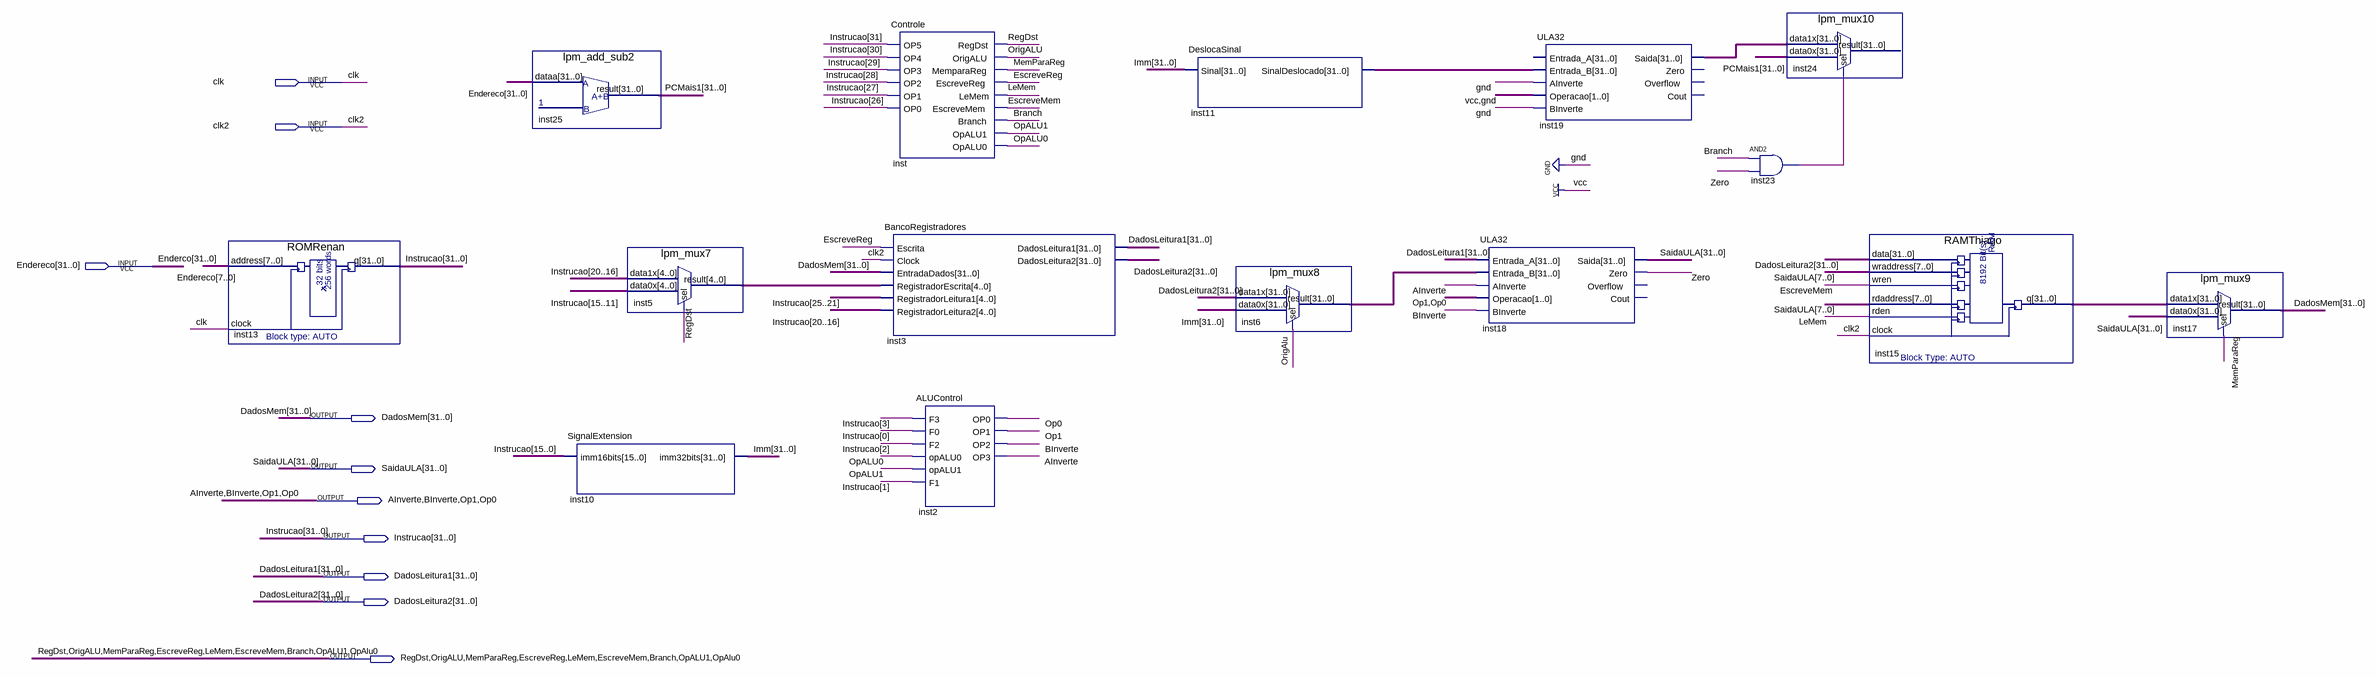
[diagram p0: schematic sheet]
// Quartus schematic MIPSUnicicloManual.bdf as structural Verilog: 15 symbols, 10 pins
module MIPSUnicicloManual (
  input  clk,
  input  clk2,
  input  [31:0] Endereco,
  output [31:0] DadosMem,
  output [31:0] SaidaULA,
  output AInverte,
  output BInverte,
  output Op1,
  output Op0,
  output [31:0] Instrucao,
  output [31:0] DadosLeitura1,
  output [31:0] DadosLeitura2,
  output RegDst,
  output OrigALU,
  output MemParaReg,
  output EscreveReg,
  output LeMem,
  output EscreveMem,
  output Branch,
  output OpALU1,
  output OpAlu0
);

  wire inst23_out, Zero;
  wire [4:0] inst5_result;
  wire [31:0] Imm, inst6_result, inst11_sinaldeslocado, inst15_q, inst19_saida, PCMais1;

  ROMRenan inst13 (.address(Endereco[7:0]), .clock(clk), .q(Instrucao));
  lpm_add_sub2 inst25 (.dataa(Endereco), .result(PCMais1));
  SignalExtension inst10 (.imm16bits(Instrucao[15:0]), .imm32bits(Imm));
  lpm_mux7 inst5 (.data1x(Instrucao[20:16]), .data0x(Instrucao[15:11]), .sel(RegDst), .result(inst5_result));
  Controle inst (
    .OP5(Instrucao[31]), .OP4(Instrucao[30]), .OP3(Instrucao[29]), .OP2(Instrucao[28]), .OP1(Instrucao[27]),
    .OP0(Instrucao[26]), .RegDst(RegDst), .OrigALU(OrigALU), .MemparaReg(MemParaReg),
    .EscreveReg(EscreveReg), .LeMem(LeMem), .EscreveMem(EscreveMem), .Branch(Branch), .OpALU1(OpALU1),
    .OpALU0(OpAlu0));
  BancoRegistradores inst3 (
    .Escrita(EscreveReg), .Clock(clk2), .EntradaDados(DadosMem), .RegistradorEscrita(inst5_result),
    .RegistradorLeitura1(Instrucao[25:21]), .RegistradorLeitura2(Instrucao[20:16]),
    .DadosLeitura1(DadosLeitura1), .DadosLeitura2(DadosLeitura2));
  ALUControl inst2 (
    .F3(Instrucao[3]), .F0(Instrucao[0]), .F2(Instrucao[2]), .opALU0(OpAlu0), .opALU1(OpALU1),
    .F1(Instrucao[1]), .OP0(Op0), .OP1(Op1), .OP2(BInverte), .OP3(AInverte));
  DeslocaSinal inst11 (.Sinal(Imm), .SinalDeslocado(inst11_sinaldeslocado));
  lpm_mux8 inst6 (.data1x(DadosLeitura2), .data0x(Imm), .sel(OrigALU), .result(inst6_result));
  ULA32 inst18 (
    .Entrada_A(DadosLeitura1), .Entrada_B(inst6_result), .AInverte(AInverte), .Operacao({Op1, Op0}),
    .BInverte(BInverte), .Saida(SaidaULA), .Zero(Zero));  // open: Overflow, Cout
  ULA32 inst19 (
    .Entrada_B(inst11_sinaldeslocado), .AInverte(1'b0), .Operacao(2'b10), .BInverte(1'b0),
    .Saida(inst19_saida));  // open: Entrada_A, Zero, Overflow, Cout
  and inst23 (inst23_out, Branch, Zero);
  lpm_mux10 inst24 (.data1x(inst19_saida), .data0x(PCMais1), .sel(inst23_out));  // open: result
  RAMThiago inst15 (
    .data(DadosLeitura2), .wraddress(SaidaULA[7:0]), .wren(EscreveMem), .rdaddress(SaidaULA[7:0]),
    .rden(LeMem), .clock(clk2), .q(inst15_q));
  lpm_mux9 inst17 (.data1x(inst15_q), .data0x(SaidaULA), .sel(MemParaReg), .result(DadosMem));

  // Other names for the same wires on the sheet: Enderco[31:0] = Endereco
endmodule
